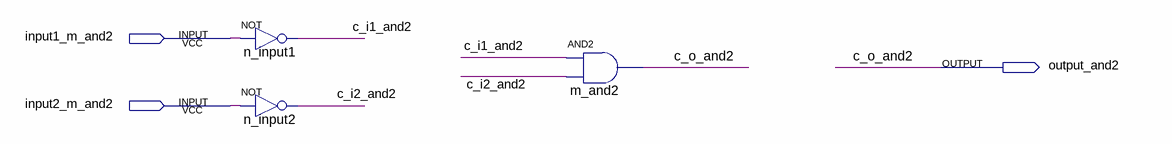
[diagram p0: schematic sheet]
// Quartus schematic m_and2.bdf as structural Verilog: 3 symbols, 3 pins
module m_and2 (
  input  input1_m_and2,
  input  input2_m_and2,
  output output_and2
);

  wire c_i1_and2, c_i2_and2;

  not n_input1 (c_i1_and2, input1_m_and2);
  not n_input2 (c_i2_and2, input2_m_and2);
  and m_and2 (output_and2, c_i1_and2, c_i2_and2);

  // Other names for the same wires on the sheet: c_o_and2 = output_and2
endmodule
